# EAGLE schematic gxb172-opamp-mk-1.0.0 (EAGLE 9.2.2)
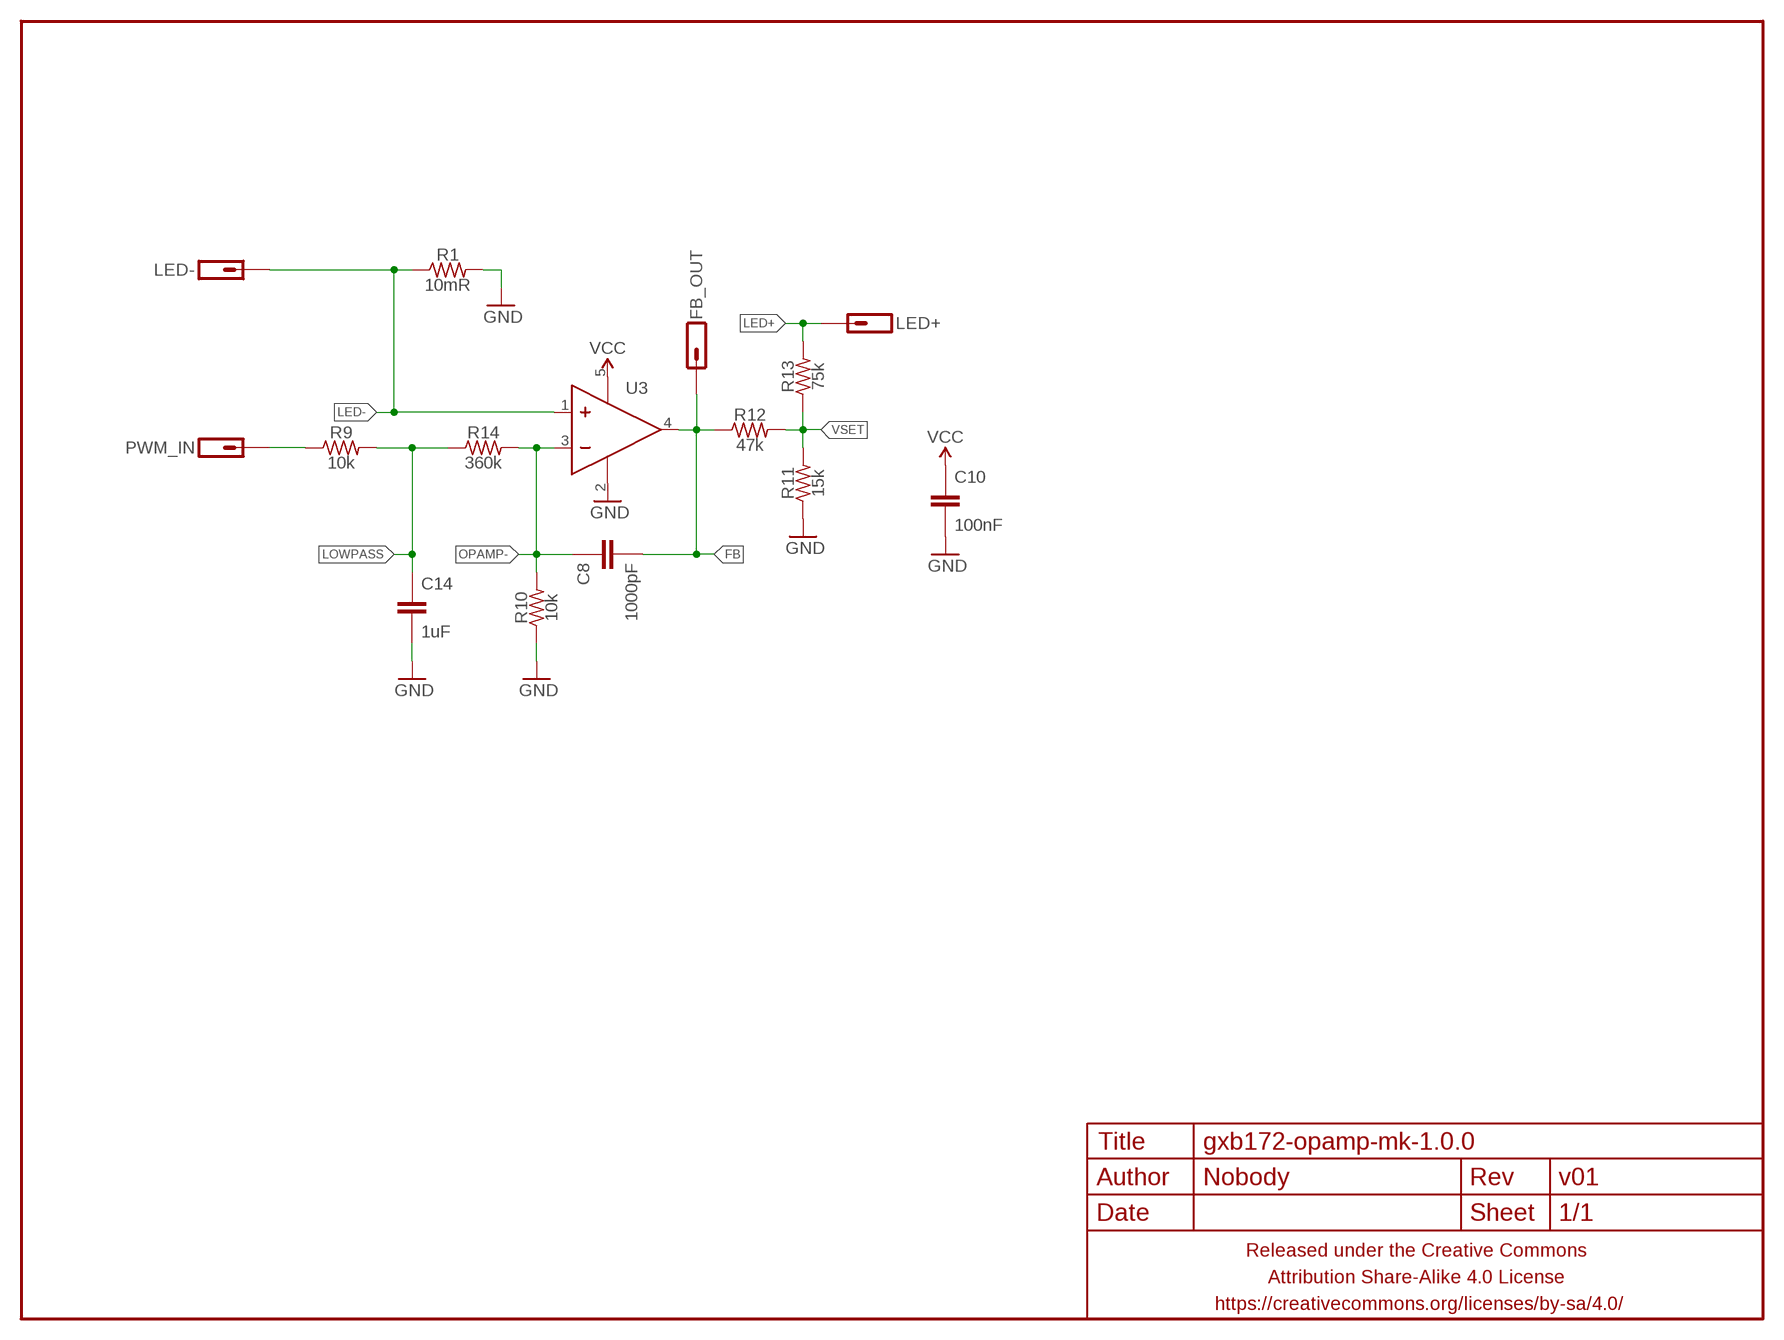
[diagram p0: schematic, sheet 1]

## Parts
C8  1000pF  CAPACITOR-CERAMICC0402  [C0402]
C10  100nF  CAPACITOR-CERAMICC0402  [C0402]
C14  1uF  CAPACITOR-CERAMICC0402  [C0402]
FB_OUT  M01PTH  [1X01]
FRAME1  FRAME-LETTERNO_PACKAGE  [DUMMY]
LED+  M01PTH  [1X01]
LED-  M01PTH  [1X01]
PWM_IN  M01PTH  [1X01]
R1  10mR  RESISTORR0805-TIGHTER  [R0805-TIGHTER]
R9  10k  RESISTORR0402  [R0402]
R10  10k  RESISTORR0402  [R0402]
R11  15k  RESISTORR0402  [R0402]
R12  47k  RESISTORR0402  [R0402]
R13  75k  RESISTORR0402  [R0402]
R14  360k  RESISTORR0402  [R0402]
U3  OPAMPOPA333-SC-70  [SC70]

## Nets
FB: C8.2 FB_OUT.1 R12.1 U3.4(OUT)
GND: C10.2 C14.2 R1.2 R10.1 R11.1 U3.2(V-)
LED+: LED+.1 R13.2
LED-: LED-.1 R1.1 U3.1(IN+)
LOWPASS: C14.1 R9.2 R14.1
OPAMP-: C8.1 R10.2 R14.2 U3.3(IN-)
PWM_IN: PWM_IN.1 R9.1
VCC: C10.1 U3.5(V+)
VSET: R11.2 R12.2 R13.1

## Library data of the parts
C8 C10 C14 = a_parts:CAPACITOR-CERAMIC: CAPACITOR, European symbol
FB_OUT LED+ LED- PWM_IN = a_parts:M01: Header 1 Standard 1-pin 0.1" header. Use with straight break away headers (SKU : PRT-00116), right angle break away headers (PRT-00553), swiss pins (PRT-00743), machine pins (PRT-00117), and female headers (PRT-00115).
FRAME1 = a_parts:FRAME-LETTER: Schematic Frame Standard 8.5x11 US Letter frame; DESIGNER: Nobody; VERSION: v01
R1 R9-R14 = a_parts:RESISTOR: RESISTOR, American symbol
U3 = a_parts:OPAMP